# Altium project Front_Extended_Base.PrjPcb
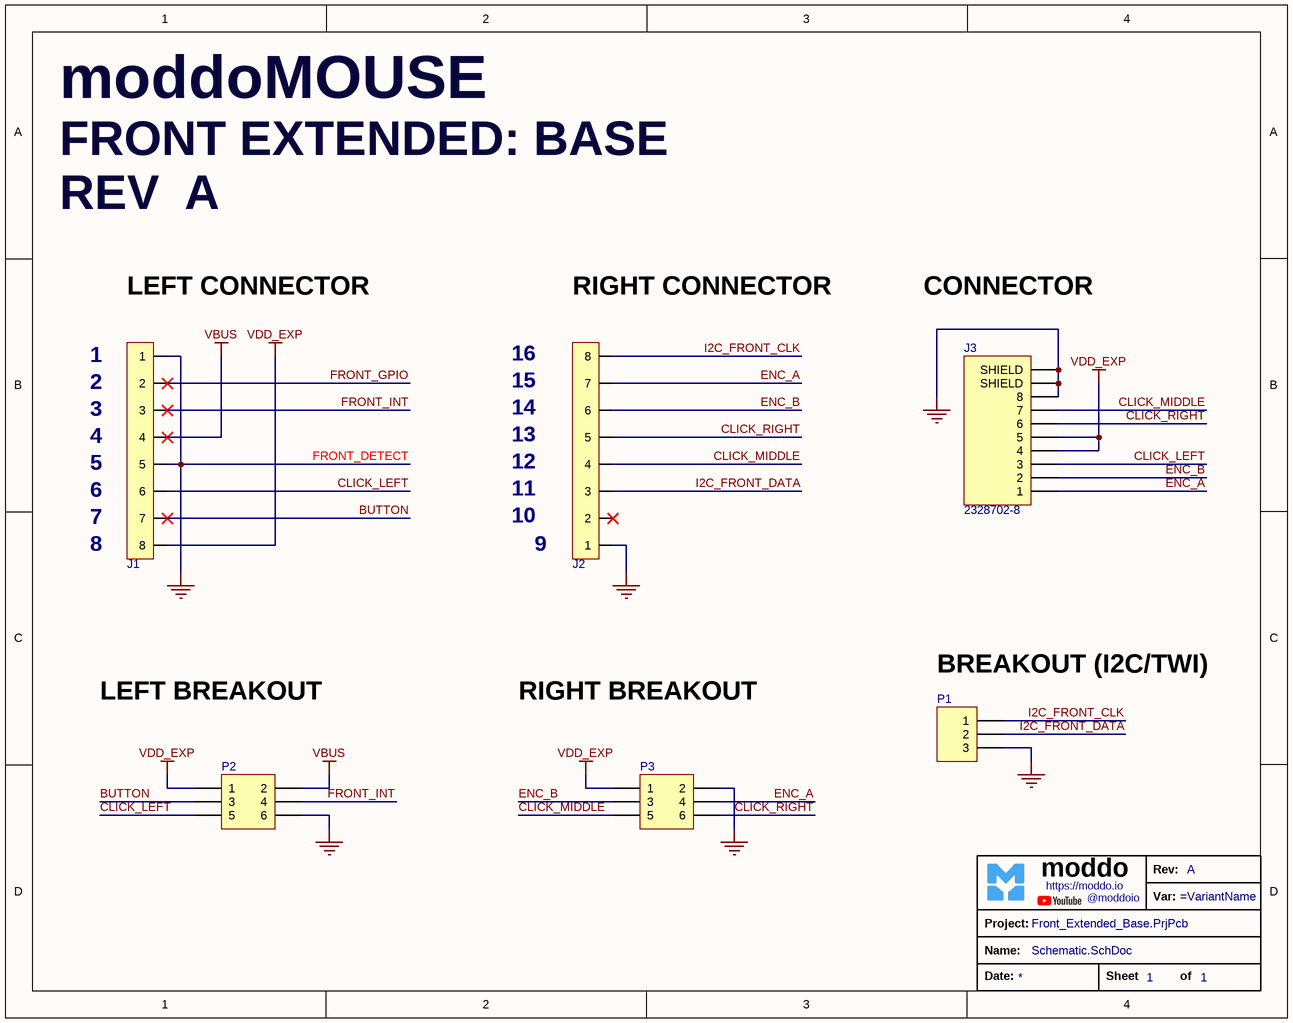
[diagram p0: Schematic.SchDoc]
Revision: A
1 sheet, 7 parts. Net scope: global (net labels, ports and power ports of the same name join across sheets).
Board file: PCB.PcbDoc

## Sheet Schematic.SchDoc
size A; SheetNumber: 1; SheetTotal: 1

### Parts
?  TitleBlock_moddo  (value not drawn)  (graphical)
J1  1.27mm_8pins  [1.27mm_8pins_MaleHeader]  (value not drawn)
J2  1.27mm_8pins  [1.27mm_8pins_MaleHeader]  (value not drawn)
J3  2328702-8  [2328702-8]
P1  Header 3  [HDR1X3]  (value not drawn)
P2  Header 3X2  [HDR2X3]  (value not drawn)
P3  Header 3X2  [HDR2X3]  (value not drawn)

### Nets
GND: J1.1 J1.5 J2.1 J3.8 J3.S1(SHIELD) J3.S2(SHIELD) P1.3 P2.6 P3.2
VBUS: J1.4 P2.2
VDD_EXP: J1.8 J3.4 J3.5 P2.1 P3.1
BUTTON: J1.7 P2.3
CLICK_LEFT: J1.6 J3.3 P2.5
CLICK_MIDDLE: J2.4 J3.7 P3.5
CLICK_RIGHT: J2.5 J3.6 P3.6
ENC_A: J2.7 J3.1 P3.4
ENC_B: J2.6 J3.2 P3.3
FRONT_GPIO: J1.2
FRONT_INT: J1.3 P2.4
I2C_FRONT_CLK: J2.8 P1.1
I2C_FRONT_DATA: J2.3 P1.2

Not connected (* = marked no-connect by the designer): J2 2*

### Notes on the sheet
- moddoMOUSE
- FRONT EXTENDED: BASE
- REV
- LEFT CONNECTOR
- RIGHT CONNECTOR
- CONNECTOR
- (near J1) 1
- (near J2) 16
- (near J1) 3
- (near J1) 2
- (near J2) 14
- (near J2) 15
- (near J1) 6
- (near J1) 5
- (near J1) 4
- FRONT_DETECT
- (near J2) 11
- (near J2) 12
- (near J2) 13
- (near J1) 8
- (near J1) 7
- (near J2) 10
- (near J2) 9
- LEFT BREAKOUT
- RIGHT BREAKOUT
- (near P1) BREAKOUT (I2C/TWI)
- (in symbol TitleBlock_moddo) Rev:; moddo; https://moddo.io; Var:; @moddoio; Project:; Name:; Date:; Sheet; of

### Library data of the parts
J1 J2 = 1.27mm_8pins: 1.27mm 1.27mm 1A 1 Gold -40℃~+105℃ 8P Phosphor Bronze Through Hole 1x8P Top 4.3mm Square Hole Through Hole,P=1.27mm Female Headers ROHS; Manufacturer: N/A; Manufacturer Part Number: N/A
J3 = 2328702-8: FFC/FPC Connector, 8 Contact(s), 1 Row(s), Right Angle, Solder Terminal, Natural Insulator; Manufacturer: TE Connectivity; Actuator Material: Thermoplastic; Actuator Color: Black; Plating: Gold; Number of Positions: 8; Voltage Rating: 50V; Connector System: Wire-to-Board; Gender: Receptacle; Sealable: No (Without); Supplier 1: Arrow Electronics; Manufacturer Part Number: 2328702-8; RoHS: Yes; Category: FFC / FPC; Stock 1: 56000; Pricing 1: 28000=0.0961 (USD); Mounting Technology: Surface Mount; Contact Material: Copper Alloy; Contact Plating: Gold; Housing Material: Thermoplastic; Housing Color: Natural; Min Operating Temperature: -40°C; Max Operating Temperature: 85°C; Packaging: Cut Tape; Termination: Solder; Series: -; Number of Contacts: 8; Number of Rows: 1; Operating Supply Voltage: 50V; Orientation: Right Angle; Length: 6mm; Height: 1mm; Flammability Rating: UL94 V-0; ComponentLink1URL: https://www.te.com/commerce/DocumentDelivery/DDEController?Action=srchrtrv&amp;DocNm=2328702&amp;DocType=Customer+Drawing&amp;DocLang=English&src-supplier=Digikey; ComponentLink1Description: https://www.te.com/commerce/DocumentDelivery/DDEController?Action=srchrtrv&amp;DocNm=2328702&amp;DocType=Customer+Drawing&amp;DocLang=English&src-supplier=Digikey; Supplier Part Number 1: 2328702-8
P1 = Header 3: Header, 3-Pin; LatestRevisionDate: 17-Jul-2002; LatestRevisionNote: Re-released for DXP Platform.; Publisher: Altium Limited; Manufacturer: N/A; Manufacturer Part Number: N/A
P2 P3 = Header 3X2: Header, 3-Pin, Dual row; LatestRevisionDate: 17-Jul-2002; LatestRevisionNote: Re-released for DXP Platform.; Publisher: Altium Limited; Manufacturer: N/A; Manufacturer Part Number: N/A

## Assembly variants
Main: not fitted P1 P2 P3